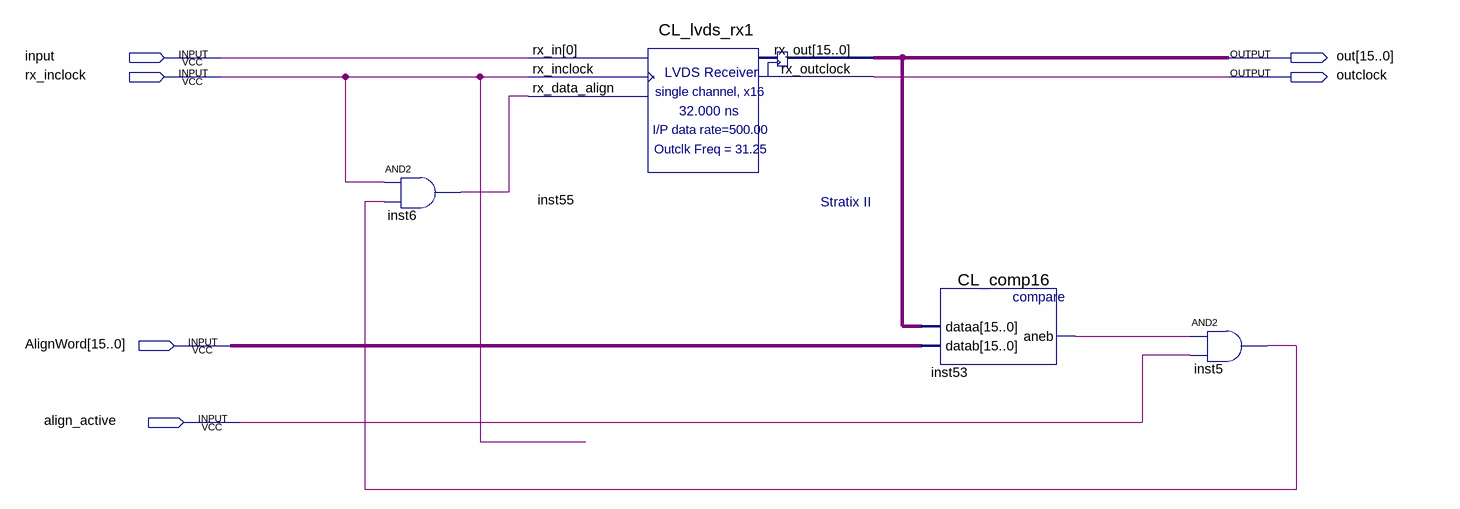
[diagram p0: schematic sheet]
// Quartus schematic CL_Rx_1.bdf as structural Verilog: 4 symbols, 6 pins
module CL_Rx_1 (
  input  \input ,
  input  rx_inclock,
  input  [15:0] AlignWord,
  input  align_active,
  output [15:0] out,
  output outclock
);

  wire inst5_out, inst6_out, inst53_aneb;

  and inst6 (inst6_out, rx_inclock, inst5_out);
  CL_lvds_rx1 inst55 (
    .rx_in(\input ), .rx_inclock(rx_inclock), .rx_data_align(inst6_out), .rx_out(out), .rx_outclock(outclock));
  CL_comp16 inst53 (.dataa(out), .datab(AlignWord), .aneb(inst53_aneb));
  and inst5 (inst5_out, inst53_aneb, align_active);
endmodule
